# Altium project 110-00315-D_B1-DevKit_1.PrjPcb (part 5 of 5)
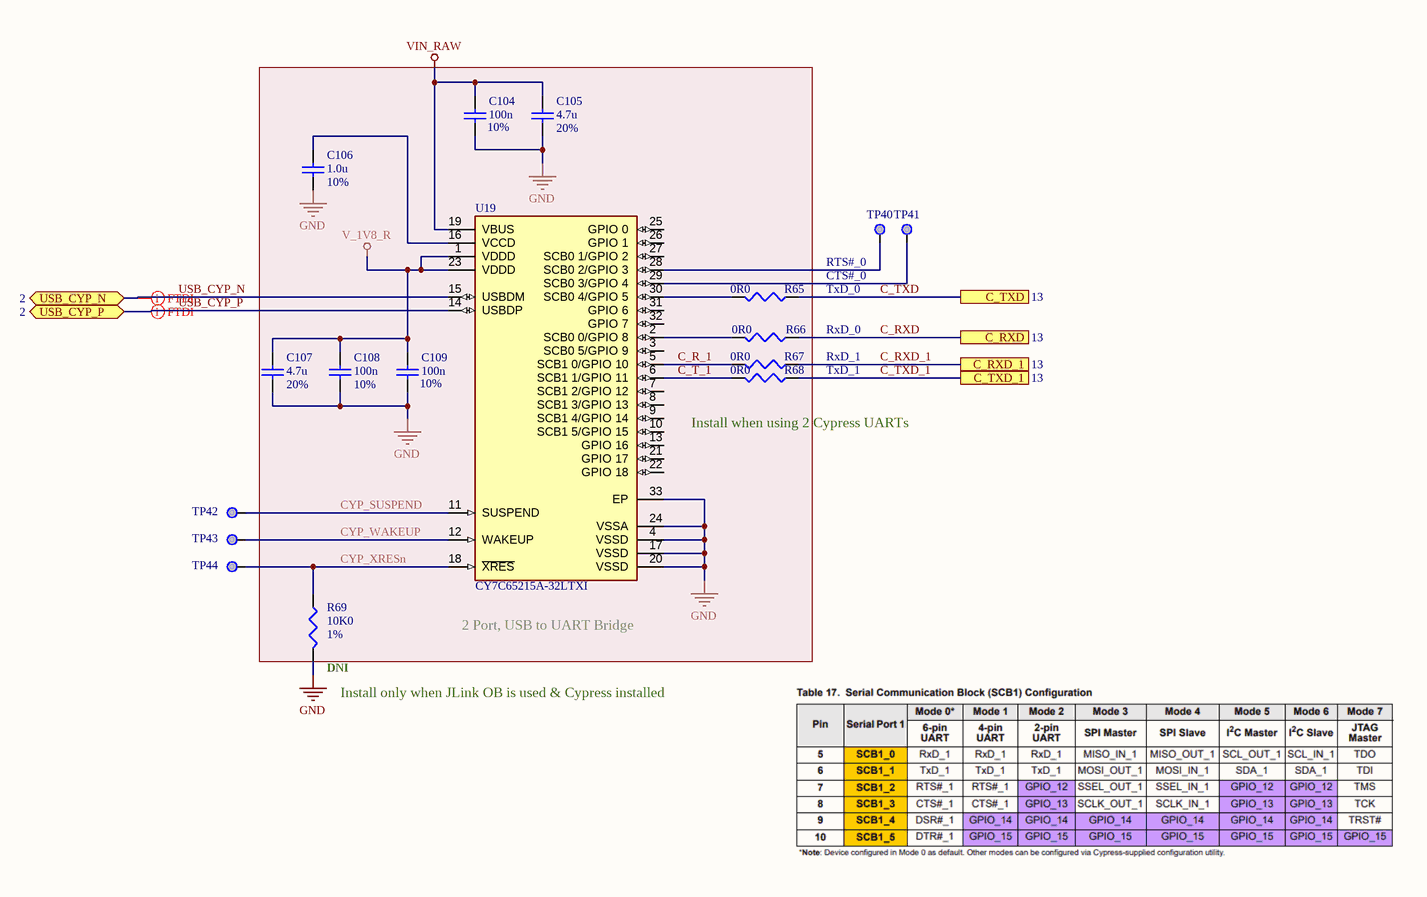
[diagram p14: 14-Cypress.SchDoc]

## Nets that join several sheets
GND: 2-PowerInput (47 pins), 3-CPUPower (32 pins), 4-CPUMipiXo (17 pins), 5-Memory (27 pins), 6-CODEC (13 pins), 7-IO_Headers (16 pins), 8-SensorsAndJTAG (33 pins), 9-MIPI (24 pins), 10-Click (17 pins), 11-CPU_GPIO (R81.1 R82.1), 12-JLINK_1 (46 pins), 13-JLINK_2 (14 pins), 14-Cypress (12 pins)
USB_D_VBUS: 2-PowerInput (C8.2 D4.2 FB2.2 TP1.1), 3-CPUPower (R25.1)
USB_U_VBUS: 2-PowerInput (6 pins), 12-JLINK_1 (R88.1)
V_1V8_R: 2-PowerInput (S2.2), 3-CPUPower (JP3.3 JP5.2 SH3.2 SH5.1), 4-CPUMipiXo (R30.2), 5-Memory (20 pins), 6-CODEC (9 pins), 7-IO_Headers (13 pins), 8-SensorsAndJTAG (20 pins), 9-MIPI (C96.1 C98.1 J16.7), 10-Click (9 pins), 11-CPU_GPIO (R77.2 R78.2 R83.2 R84.2), 12-JLINK_1 (9 pins), 13-JLINK_2 (J22.1 J22.13 R103.1), 14-Cypress (5 pins)
V_3V3: 2-PowerInput (R14.1 S1.2), 3-CPUPower (JP1.2 JP3.1 JP6.1 SH1.1), 5-Memory (C52.1 C83.2 U8.A3 U11.1), 9-MIPI (5 pins), 10-Click (C113.2 C114.2 J19.7 JP9.3), 12-JLINK_1 (11 pins)
VDD_IO_FLEX: 3-CPUPower (C26.2 JP6.2 SH6.2 U3.K5), 7-IO_Headers (C80.2 J10.36), 8-SensorsAndJTAG (C93.2 U17.5)
VDD_MAIN: 3-CPUPower (C20.2 JP4.1 SH4.2 U3.L12), 4-CPUMipiXo (C43.2 U5.3)
VIN_RAW: 2-PowerInput (14 pins), 6-CODEC (C75.2 R46.2 U10.1), 8-SensorsAndJTAG (C94.1 U17.3), 9-MIPI (C100.2 C101.1 L6.1 U18.5), 10-Click (C115.2 C116.2 J20.7 JP9.5), 13-JLINK_2 (D10.1), 14-Cypress (C104.2 C105.2 U19.19)
C_RXD: 13-JLINK_2 (R101.2 SW4.3 U22.R14), 14-Cypress (R66.1)
C_RXD_1: 13-JLINK_2 (R101.1 U22.E18), 14-Cypress (R67.1)
C_TXD: 13-JLINK_2 (R102.2 SW4.7 U22.M15), 14-Cypress (R65.1)
C_TXD_1: 13-JLINK_2 (R102.1 U22.E15), 14-Cypress (R68.1)
I2C_FB_SCL: 6-CODEC (U9.2), 9-MIPI (J17.4), 10-Click (Q5.2), 11-CPU_GPIO (R83.1 S15.1)
I2C_FB_SDA: 6-CODEC (U9.3), 9-MIPI (J17.5), 10-Click (Q4.2), 11-CPU_GPIO (R84.1 S14.1)
I2S_COD_SCLK: 6-CODEC (U9.29), 11-CPU_GPIO (R81.2 S10.1)
I2S_COD_WS: 6-CODEC (U9.30), 11-CPU_GPIO (R82.2 S11.1)
I3C_SCL: 8-SensorsAndJTAG (U12.13 U15.13), 11-CPU_GPIO (R77.1 S8.1)
I3C_SDA: 8-SensorsAndJTAG (U12.14 U15.14), 11-CPU_GPIO (R78.1 S9.1)
LFXO_N: 4-CPUMipiXo (TP23.1 U3.M9 Y2.1), 12-JLINK_1 (R87.2)
MIPI_DSI_0_N: 3-CPUPower (U3.A13), 9-MIPI (J16.18 TP34.1)
MIPI_DSI_0_P: 3-CPUPower (U3.A12), 9-MIPI (J16.17 TP35.1)
MIPI_DSI_C_N: 3-CPUPower (U3.B13), 9-MIPI (J16.15 TP36.1)
MIPI_DSI_C_P: 3-CPUPower (U3.B12), 9-MIPI (J16.14 TP37.1)
NSRST: 7-IO_Headers (J11.9), 8-SensorsAndJTAG (J12.10 J13.10 R51.2), 11-CPU_GPIO (U3.M8), 13-JLINK_2 (U22.K5)
NSRST_J: 12-JLINK_1 (U22.J12), 13-JLINK_2 (J22.12 R103.2)
P0_0: 7-IO_Headers (J9.2), 11-CPU_GPIO (U3.H13), 13-JLINK_2 (J21.3 S16.2)
P0_1: 7-IO_Headers (J9.4), 11-CPU_GPIO (U3.J13), 13-JLINK_2 (J21.2 S17.2)
P0_2: 5-Memory (S4.1), 7-IO_Headers (J9.3), 11-CPU_GPIO (U3.J12)
P0_3: 7-IO_Headers (J9.5), 10-Click (R75.1 R76.1), 11-CPU_GPIO (U3.K8)
P0_4: 5-Memory (U8.E3), 7-IO_Headers (J9.7), 11-CPU_GPIO (U3.H6)
P0_5: 7-IO_Headers (J9.9), 11-CPU_GPIO (S8.2 U3.H10)
P0_6: 7-IO_Headers (J9.8), 11-CPU_GPIO (S9.2 U3.H8)
P0_7: 7-IO_Headers (J11.8), 8-SensorsAndJTAG (J12.4 J13.4), 11-CPU_GPIO (U3.J4), 13-JLINK_2 (U22.J5)
P1_0: 7-IO_Headers (J11.2), 8-SensorsAndJTAG (J12.2 J13.2), 11-CPU_GPIO (U3.D8), 13-JLINK_2 (U22.M5)
P1_1: 7-IO_Headers (J11.4), 8-SensorsAndJTAG (J12.8 J13.8), 11-CPU_GPIO (U3.D7), 13-JLINK_2 (U22.G5)
P1_2: 7-IO_Headers (J11.3), 8-SensorsAndJTAG (J12.6 J13.6), 11-CPU_GPIO (U3.D5), 13-JLINK_2 (U22.H5 U22.R10)
P1_3: 7-IO_Headers (J11.5), 8-SensorsAndJTAG (S7.1), 11-CPU_GPIO (U3.N2)
P1_4: 7-IO_Headers (J10.32), 8-SensorsAndJTAG (U17.1), 11-CPU_GPIO (U3.K4)
P1_5: 7-IO_Headers (J10.34), 8-SensorsAndJTAG (U17.8), 11-CPU_GPIO (U3.M4)
P1_6: 7-IO_Headers (J10.38), 11-CPU_GPIO (S10.2 U3.N4)
P1_7: 7-IO_Headers (J10.40), 11-CPU_GPIO (S11.2 U3.M5)
P2_0: 7-IO_Headers (J9.12), 11-CPU_GPIO (U3.K9), 13-JLINK_2 (SW4.8)
P2_1: 5-Memory (S5.1), 7-IO_Headers (J9.14), 11-CPU_GPIO (U3.K7)
P2_3: 7-IO_Headers (J9.15), 9-MIPI (R63.1), 11-CPU_GPIO (U3.N8)
P2_4: 6-CODEC (U9.31), 7-IO_Headers (J9.17), 11-CPU_GPIO (U3.N7)
P2_5: 6-CODEC (U9.32), 7-IO_Headers (J9.19), 11-CPU_GPIO (U3.M7)
P2_6: 5-Memory (U8.C1), 7-IO_Headers (J9.18), 11-CPU_GPIO (U3.N6)
P2_7: 5-Memory (U8.D2), 7-IO_Headers (J9.20), 11-CPU_GPIO (U3.M6)
P3_0: 5-Memory (TP27.1 U6.D3 U7.D3), 11-CPU_GPIO (U3.E2)
P3_1: 5-Memory (TP26.1 U6.D2 U7.D2), 11-CPU_GPIO (U3.E4)
P3_2: 5-Memory (U6.C4 U7.C4), 11-CPU_GPIO (U3.F2)
P3_3: 5-Memory (U6.D4 U7.D4), 11-CPU_GPIO (U3.G2)
P3_4: 5-Memory (U6.D5 U7.D5), 11-CPU_GPIO (U3.H2)
P3_5: 5-Memory (U6.E3 U7.E3), 11-CPU_GPIO (U3.D4)
P3_6: 5-Memory (U6.E2 U7.E2), 11-CPU_GPIO (U3.J2)
P3_7: 5-Memory (U6.E1 U7.E1), 11-CPU_GPIO (U3.H1)
P4_0: 5-Memory (U6.B1 U7.B1), 11-CPU_GPIO (U3.K2)
P4_1: 5-Memory (R37.1), 11-CPU_GPIO (U3.J1)
P4_2: 5-Memory (TP28.1 U6.B2 U7.B2), 11-CPU_GPIO (U3.F4)
P4_3: 2-PowerInput (Q3.1 R15.2), 7-IO_Headers (J11.15), 8-SensorsAndJTAG (J12.12), 11-CPU_GPIO (U3.F6)
P4_4: 7-IO_Headers (J11.17), 8-SensorsAndJTAG (J12.14), 11-CPU_GPIO (U3.A6)
P4_5: 2-PowerInput (Q2.1 R13.2), 7-IO_Headers (J11.19), 8-SensorsAndJTAG (J12.16), 11-CPU_GPIO (U3.B6)
P4_6: 7-IO_Headers (J11.10), 8-SensorsAndJTAG (J12.18), 11-CPU_GPIO (U3.B5)
P4_7: 2-PowerInput (Q1.1 R11.2), 7-IO_Headers (J11.12), 8-SensorsAndJTAG (J12.20), 11-CPU_GPIO (U3.D6)
P5_0: 7-IO_Headers (J10.2), 10-Click (SW3.1), 11-CPU_GPIO (U3.H12)
P5_1: 7-IO_Headers (J10.4), 8-SensorsAndJTAG (U12.4), 11-CPU_GPIO (U3.G13)
P5_2: 7-IO_Headers (J10.3), 11-CPU_GPIO (U3.F13), 13-JLINK_2 (SW4.6)
P5_3: 7-IO_Headers (J10.5), 11-CPU_GPIO (U3.G12), 13-JLINK_2 (SW4.2)
P5_4: 7-IO_Headers (J10.7), 10-Click (SW3.4), 11-CPU_GPIO (U3.G10)
P5_5: 7-IO_Headers (J10.9), 10-Click (SW3.3), 11-CPU_GPIO (U3.E13)
P5_6: 7-IO_Headers (J10.8), 10-Click (SW3.6), 11-CPU_GPIO (U3.F12)
P5_7: 7-IO_Headers (J10.10), 10-Click (SW3.2), 11-CPU_GPIO (U3.D13)
P6_0: 5-Memory (U8.D1), 7-IO_Headers (J10.12), 11-CPU_GPIO (U3.E12)
P6_1: 5-Memory (U8.E1), 7-IO_Headers (J10.14), 11-CPU_GPIO (U3.B11)
P6_2: 5-Memory (U8.A1), 7-IO_Headers (J10.13), 11-CPU_GPIO (U3.A11)
P6_3: 5-Memory (U8.B1), 7-IO_Headers (J10.15), 11-CPU_GPIO (U3.A10)
P6_4: 7-IO_Headers (J10.17), 10-Click (U21.6), 11-CPU_GPIO (U3.B10)
P6_5: 5-Memory (J6.9 U8.B2), 7-IO_Headers (J10.19), 11-CPU_GPIO (U3.F10)
P6_6: 7-IO_Headers (J10.18), 8-SensorsAndJTAG (U15.4), 11-CPU_GPIO (U3.E10)
P6_7: 6-CODEC (U9.1), 7-IO_Headers (J10.20), 11-CPU_GPIO (U3.D10)
P7_0: 5-Memory (U11.3), 7-IO_Headers (J10.22), 11-CPU_GPIO (U3.D9)
P7_1: 7-IO_Headers (J10.24), 11-CPU_GPIO (U3.A5), 13-JLINK_2 (SW4.4)
P7_2: 7-IO_Headers (J10.23), 11-CPU_GPIO (S14.2 U3.A4)
P7_3: 7-IO_Headers (J10.25), 11-CPU_GPIO (S15.2 U3.B4)
P7_4: 7-IO_Headers (J10.27), 8-SensorsAndJTAG (U14.6 U16.6), 11-CPU_GPIO (U3.B3)
P7_5: 7-IO_Headers (J10.29), 8-SensorsAndJTAG (R53.2 R55.2), 11-CPU_GPIO (U3.B7)
P7_6: 7-IO_Headers (J10.28), 10-Click (U20.3), 11-CPU_GPIO (U3.G4)
P7_7: 7-IO_Headers (J10.30), 10-Click (U21.7), 11-CPU_GPIO (U3.L2)
P8_0: 7-IO_Headers (J11.18), 9-MIPI (J16.9 R61.2), 11-CPU_GPIO (U3.K1)
P8_1: 7-IO_Headers (J11.20), 9-MIPI (R59.2 U18.4), 11-CPU_GPIO (U3.H4)
P8_2: 7-IO_Headers (J11.23), 10-Click (U21.9), 11-CPU_GPIO (U3.L1)
P8_3: 7-IO_Headers (J11.25), 10-Click (U21.8), 11-CPU_GPIO (U3.M3)
P8_4: 7-IO_Headers (J10.33), 10-Click (U21.3), 11-CPU_GPIO (U3.G6)
P8_5: 7-IO_Headers (J10.35), 10-Click (U21.1), 11-CPU_GPIO (U3.M1)
P8_6: 7-IO_Headers (J10.37), 10-Click (U21.4), 11-CPU_GPIO (U3.M2)
P8_7: 7-IO_Headers (J10.39), 10-Click (U21.5), 11-CPU_GPIO (U3.N1)
P15_0: 7-IO_Headers (J11.28), 9-MIPI (R62.1 R64.1), 11-CPU_GPIO (U3.N5)
P15_1: 5-Memory (U6.A4 U7.A4), 7-IO_Headers (J11.30), 11-CPU_GPIO (U3.K6)
POR_N: 4-CPUMipiXo (R16.1 R30.1 SW2.1 U3.J10), 7-IO_Headers (J11.7), 13-JLINK_2 (U22.L5)
SEUART_RX_J: 12-JLINK_1 (U22.A14), 13-JLINK_2 (J23.3)
SEUART_TX_J: 12-JLINK_1 (U22.A13), 13-JLINK_2 (J23.2)
USB_CYP_N: 2-PowerInput (R8.1), 14-Cypress (U19.15)
USB_CYP_P: 2-PowerInput (R9.1), 14-Cypress (U19.14)
USB_DEV_N: 2-PowerInput (D1.1 J1.2 J2.A7 J2.B7), 3-CPUPower (U3.B8)
USB_DEV_P: 2-PowerInput (D1.2 J1.3 J2.A6 J2.B6), 3-CPUPower (U3.A8)
USB_FTDI_N: 2-PowerInput (R5.1), 12-JLINK_1 (U22.V7)
USB_FTDI_P: 2-PowerInput (R6.1), 12-JLINK_1 (U22.W7)